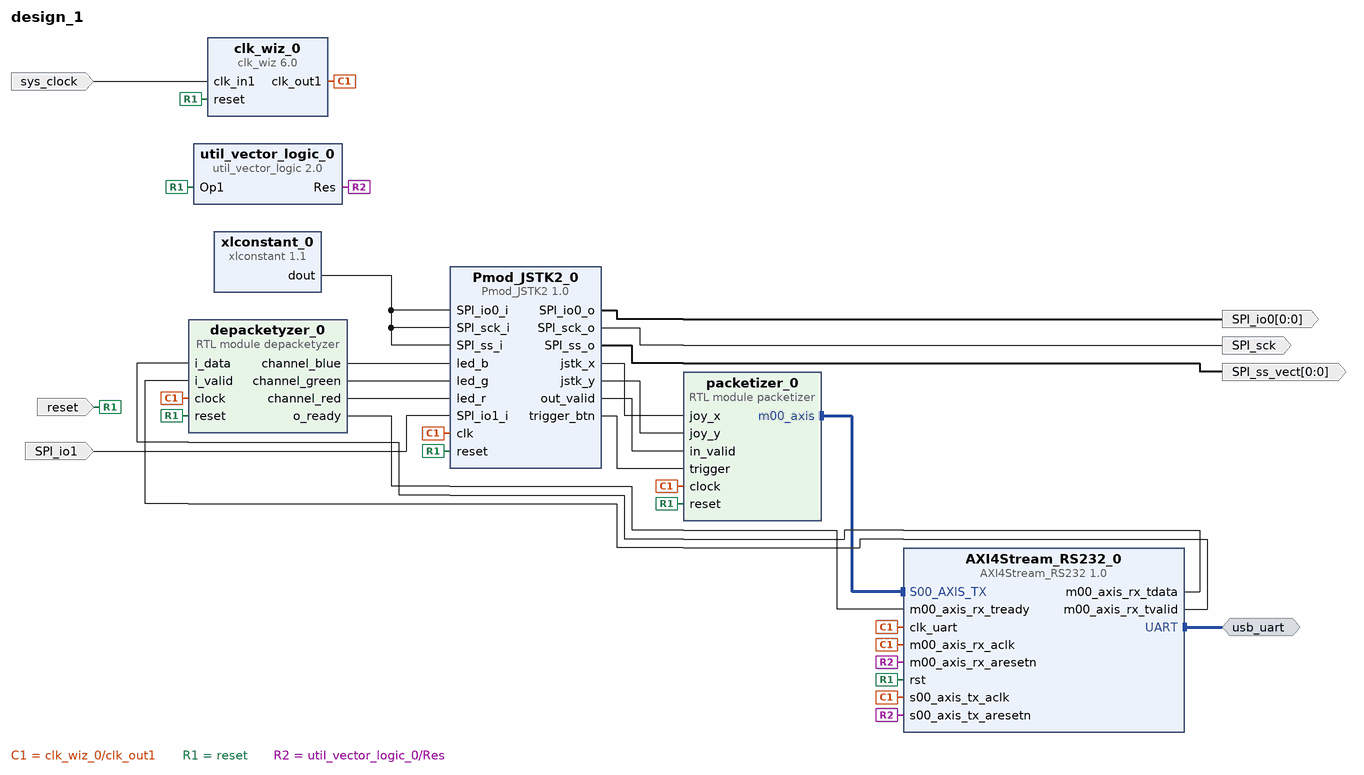
[diagram p0: block diagram of the top level]
# Vivado block design design_1, xc7a35tcpg236-1, Vivado 2020.2
create_bd_design design_1

create_bd_intf_port -mode Master -vlnv xilinx.com:interface:uart_rtl:1.0 usb_uart
create_bd_port -dir O -from 0 -to 0 SPI_io0
create_bd_port -dir I SPI_io1
create_bd_port -dir O SPI_sck
create_bd_port -dir O -from 0 -to 0 SPI_ss_vect
create_bd_port -dir I -type rst reset
set_property -dict {CONFIG.POLARITY ACTIVE_HIGH} [get_bd_ports reset]
create_bd_port -dir I -type clk sys_clock
set_property -dict {CONFIG.FREQ_HZ 100000000 CONFIG.PHASE 0.000} [get_bd_ports sys_clock]

create_bd_cell -type ip -vlnv TimeEngineers:ip:AXI4Stream_RS232:1.0 AXI4Stream_RS232_0
set_property -dict {CONFIG.UART_BOARD_INTERFACE usb_uart CONFIG.USE_BOARD_FLOW true} [get_bd_cells AXI4Stream_RS232_0]
create_bd_cell -type ip -vlnv TimeEngineers:ip:Pmod_JSTK2:1.0 Pmod_JSTK2_0
create_bd_cell -type ip -vlnv xilinx.com:ip:clk_wiz:6.0 clk_wiz_0
set_property -dict [list \
  CONFIG.CLK_IN1_BOARD_INTERFACE sys_clock \
  CONFIG.RESET_BOARD_INTERFACE reset \
  CONFIG.USE_BOARD_FLOW true \
] [get_bd_cells clk_wiz_0]
create_bd_cell -type module -reference depacketyzer depacketyzer_0
create_bd_cell -type module -reference packetizer packetizer_0
create_bd_cell -type ip -vlnv xilinx.com:ip:util_vector_logic:2.0 util_vector_logic_0
set_property -dict {CONFIG.C_OPERATION not CONFIG.C_SIZE 1} [get_bd_cells util_vector_logic_0]
create_bd_cell -type ip -vlnv xilinx.com:ip:xlconstant:1.1 xlconstant_0
set_property -dict {CONFIG.CONST_VAL 0} [get_bd_cells xlconstant_0]

# ---- connections ----

connect_bd_intf_net [get_bd_intf_pins AXI4Stream_RS232_0/S00_AXIS_TX] [get_bd_intf_pins packetizer_0/m00_axis]
connect_bd_intf_net [get_bd_intf_ports usb_uart] [get_bd_intf_pins AXI4Stream_RS232_0/UART]
connect_bd_net [get_bd_pins AXI4Stream_RS232_0/m00_axis_rx_tdata] [get_bd_pins depacketyzer_0/i_data]
connect_bd_net [get_bd_pins AXI4Stream_RS232_0/m00_axis_rx_tvalid] [get_bd_pins depacketyzer_0/i_valid]
connect_bd_net [get_bd_pins Pmod_JSTK2_0/SPI_io0_o] [get_bd_ports SPI_io0]
connect_bd_net [get_bd_pins Pmod_JSTK2_0/SPI_sck_o] [get_bd_ports SPI_sck]
connect_bd_net [get_bd_pins Pmod_JSTK2_0/SPI_ss_o] [get_bd_ports SPI_ss_vect]
connect_bd_net [get_bd_pins Pmod_JSTK2_0/jstk_x] [get_bd_pins packetizer_0/joy_x]
connect_bd_net [get_bd_pins Pmod_JSTK2_0/jstk_y] [get_bd_pins packetizer_0/joy_y]
connect_bd_net [get_bd_pins Pmod_JSTK2_0/out_valid] [get_bd_pins packetizer_0/in_valid]
connect_bd_net [get_bd_pins Pmod_JSTK2_0/trigger_btn] [get_bd_pins packetizer_0/trigger]
connect_bd_net -net SPI_io1_1 [get_bd_ports SPI_io1] [get_bd_pins Pmod_JSTK2_0/SPI_io1_i]
connect_bd_net [get_bd_pins clk_wiz_0/clk_out1] \
  [get_bd_pins AXI4Stream_RS232_0/clk_uart] [get_bd_pins AXI4Stream_RS232_0/m00_axis_rx_aclk] \
  [get_bd_pins AXI4Stream_RS232_0/s00_axis_tx_aclk] [get_bd_pins Pmod_JSTK2_0/clk] [get_bd_pins depacketyzer_0/clock] \
  [get_bd_pins packetizer_0/clock]
connect_bd_net [get_bd_pins depacketyzer_0/channel_blue] [get_bd_pins Pmod_JSTK2_0/led_b]
connect_bd_net [get_bd_pins depacketyzer_0/channel_green] [get_bd_pins Pmod_JSTK2_0/led_g]
connect_bd_net [get_bd_pins depacketyzer_0/channel_red] [get_bd_pins Pmod_JSTK2_0/led_r]
connect_bd_net [get_bd_pins depacketyzer_0/o_ready] [get_bd_pins AXI4Stream_RS232_0/m00_axis_rx_tready]
connect_bd_net [get_bd_ports reset] \
  [get_bd_pins AXI4Stream_RS232_0/rst] [get_bd_pins Pmod_JSTK2_0/reset] [get_bd_pins clk_wiz_0/reset] \
  [get_bd_pins depacketyzer_0/reset] [get_bd_pins packetizer_0/reset] [get_bd_pins util_vector_logic_0/Op1]
connect_bd_net [get_bd_ports sys_clock] [get_bd_pins clk_wiz_0/clk_in1]
connect_bd_net [get_bd_pins util_vector_logic_0/Res] \
  [get_bd_pins AXI4Stream_RS232_0/m00_axis_rx_aresetn] [get_bd_pins AXI4Stream_RS232_0/s00_axis_tx_aresetn]
connect_bd_net [get_bd_pins xlconstant_0/dout] \
  [get_bd_pins Pmod_JSTK2_0/SPI_io0_i] [get_bd_pins Pmod_JSTK2_0/SPI_sck_i] [get_bd_pins Pmod_JSTK2_0/SPI_ss_i]

validate_bd_design
save_bd_design
